# EAGLE design babyNamer (EAGLE 6.5.0)
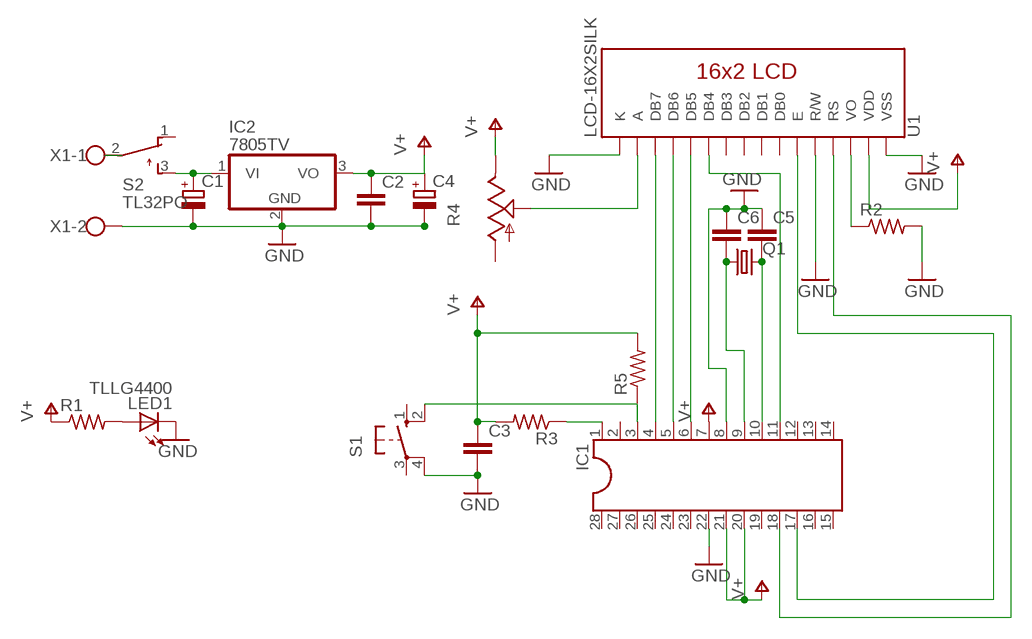
[diagram p0: schematic, sheet 1]

## Parts
C1  CPOL-EUE3.5-8  [E3,5-8]
C2  C-EU050-024X044  [C050-024X044]
C3  C-EU050-024X044  [C050-024X044]
C4  CPOL-EUE3.5-8  [E3,5-8]
C5  C-EU050-024X044  [C050-024X044]
C6  C-EU050-024X044  [C050-024X044]
IC1  DIL28-3  [DIL28-3]
IC2  7805TV  [TO220V]
LED1  TLLG4400  [LED3MM]
Q1  CRYSTALHC49US  [HC49US]
R1  R-US_0204/7  [0204/7]
R2  R-US_0204/7  [0204/7]
R3  R-US_0204/7  [0204/7]
R4  TRIM_US-CA9V  [CA9V]
R5  R-US_0204/7  [0204/7]
S1  10-XX  [B3F-10XX]
S2  TL32PO  [TL3XPO]
U1  LCD-16X2SILK  [LCD-16X2]
X1  W237-102  [W237-102]

## Nets
GND: C1.- C2.2 C3.2 C4.- C5.1 C6.1 IC1.8 IC1.22 IC2.2(GND) LED1.K(C) R2.2 S1.4(P1) U1.1(VSS) U1.5(R/W) U1.16(K) X1.2
N$1: IC1.17 U1.6(E)
N$2: R2.1 U1.3(VO)
N$3: IC1.11 U1.11(DB4)
N$4: IC1.18 U1.4(RS)
N$6: S2.2(P) X1.1
N$7: R4.S U1.15(A)
N$8: IC1.4 U1.14(DB7)
N$9: IC1.5 U1.13(DB6)
N$10: IC1.6 U1.12(DB5)
N$11: C1.+ IC2.1(VI) S2.3(S)
N$12: LED1.A R1.2
N$13: C5.2 IC1.10 Q1.2
N$14: C6.2 IC1.9 Q1.1
N$15: IC1.1 R3.1
N$16: IC1.3 R5.1 S1.2(S1)
V+: C2.1 C3.1 C4.+ IC1.7 IC1.20 IC1.21 IC2.3(VO) R1.1 R3.2 R4.E R5.2 U1.2(VDD)
Unconnected: IC1.2 IC1.12 IC1.13 IC1.14 IC1.15 IC1.16 IC1.19 IC1.23 IC1.24 IC1.25 IC1.26 IC1.27 IC1.28 R4.A S1.1(S) S1.3(P) S2.1(O) U1.7(DB0) U1.8(DB1) U1.9(DB2) U1.10(DB3)

## Library data of the parts
C1 C4 = rcl:CPOL-EU: POLARIZED CAPACITOR, European symbol
C2 C3 C5 C6 = rcl:C-EU: CAPACITOR, European symbol
IC1 = ic-package:DIL28: Dual In Line
IC2 = linear:78*: Positive VOLTAGE REGULATOR Source: http://cache.national.com/ds/LM/LM78L05.pdf http://www.fairchildsemi.com/ds/LM/LM7805.pdf
LED1 = led:TLLG4400: Low Current (2mA) LED 3 mm Tinted Diffused Package color GREEN Source: Data sheet <http://www.farnell.com/datasheets/391098.pdf>; MF: VISHAY SEMICONDUCTOR; OC_FARNELL: 1612435
Q1 = SparkFun-FreqCtrl:CRYSTAL: Various standard crystals. Proven footprints. Spark Fun Electronics SKU : COM-00534
R1-R3 R5 = rcl:R-US_: RESISTOR, American symbol
R4 = pot:TRIM_US-: POTENTIOMETER
S1 = switch-omron:10-XX: OMRON SWITCH; MPN: B3F-1000; OC_FARNELL: 176432; OC_NEWARK: 36M3542
S2 = switch:TL32PO: TINY SWITCH ON - MOM Source: http://www2.produktinfo.conrad.com/datenblaetter/700000-724999/705152-da-01-de-Subminiaturschalter_TL_36YO.pdf
U1 = SparkFun-Displays:LCD-16X2: Standard text-only 16x2 parallel input LCD
X1 = con-wago-500:W237-102: WAGO SCREW CLAMP; MPN: 237-102; OC_FARNELL: unknown; OC_NEWARK: 70K9898

## Board
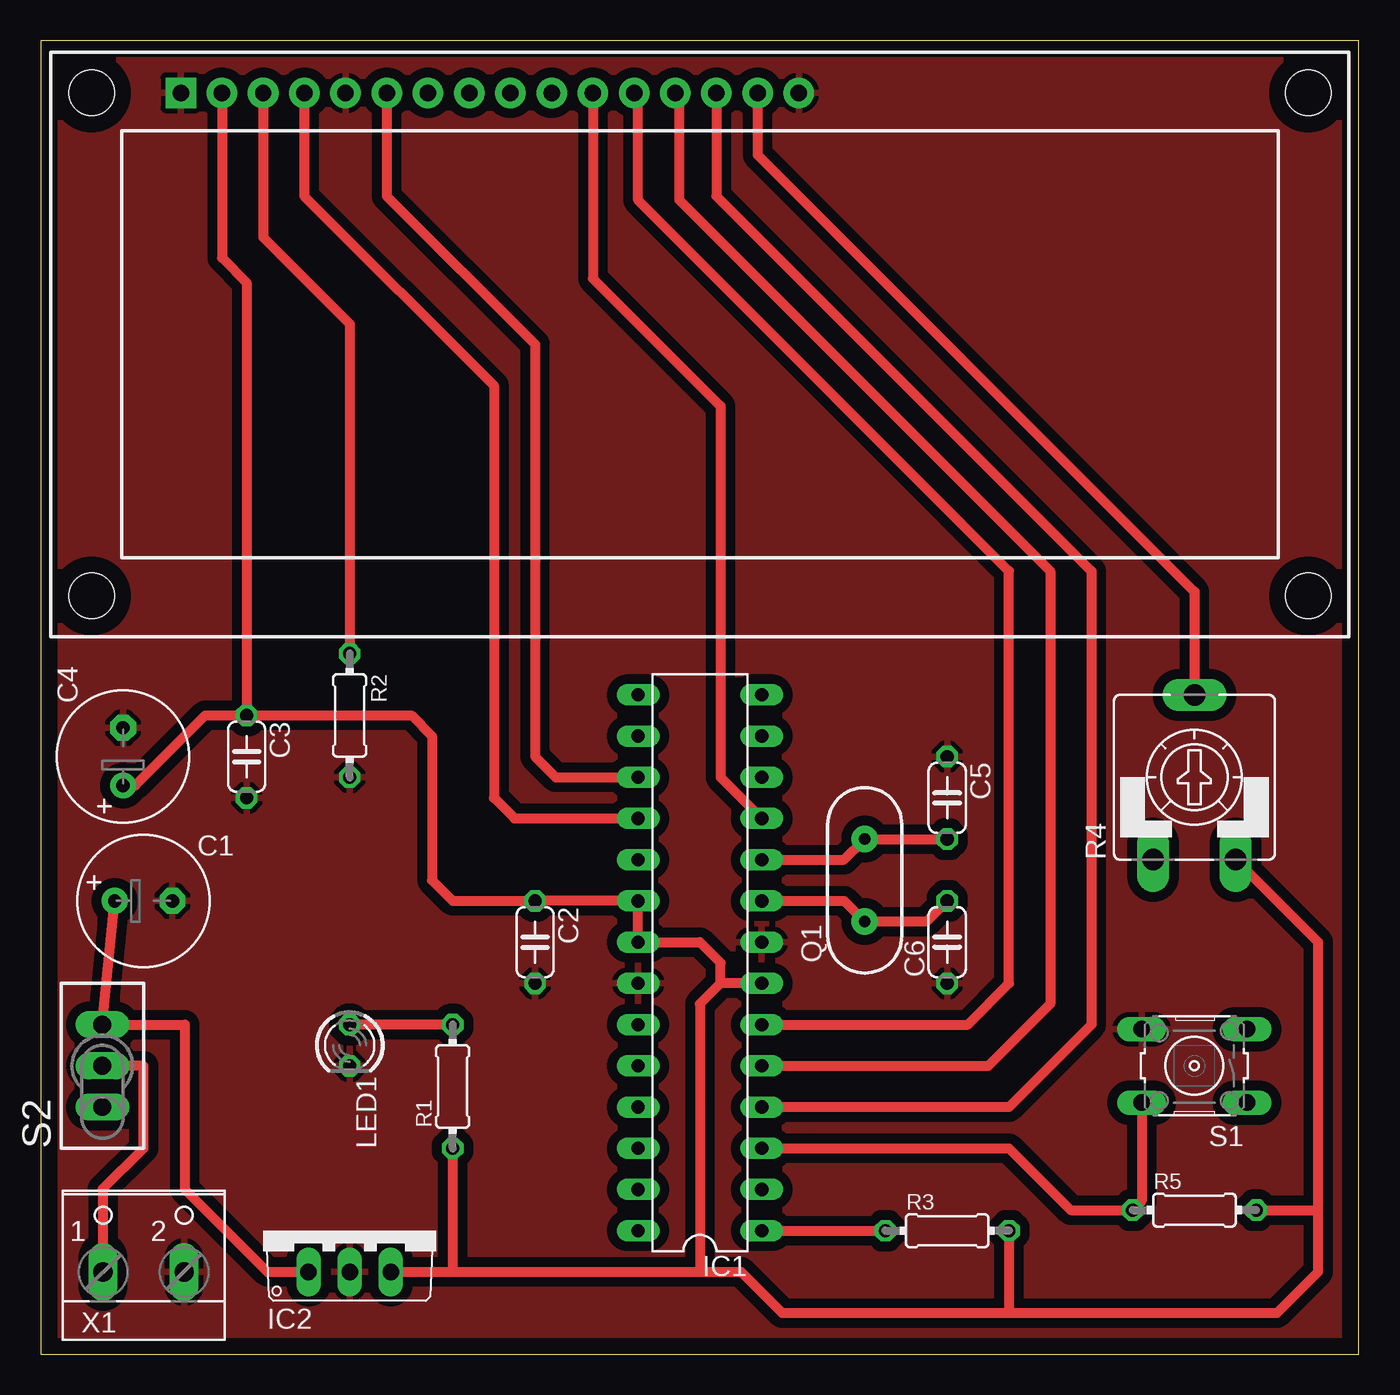
[diagram p1: board, top side]
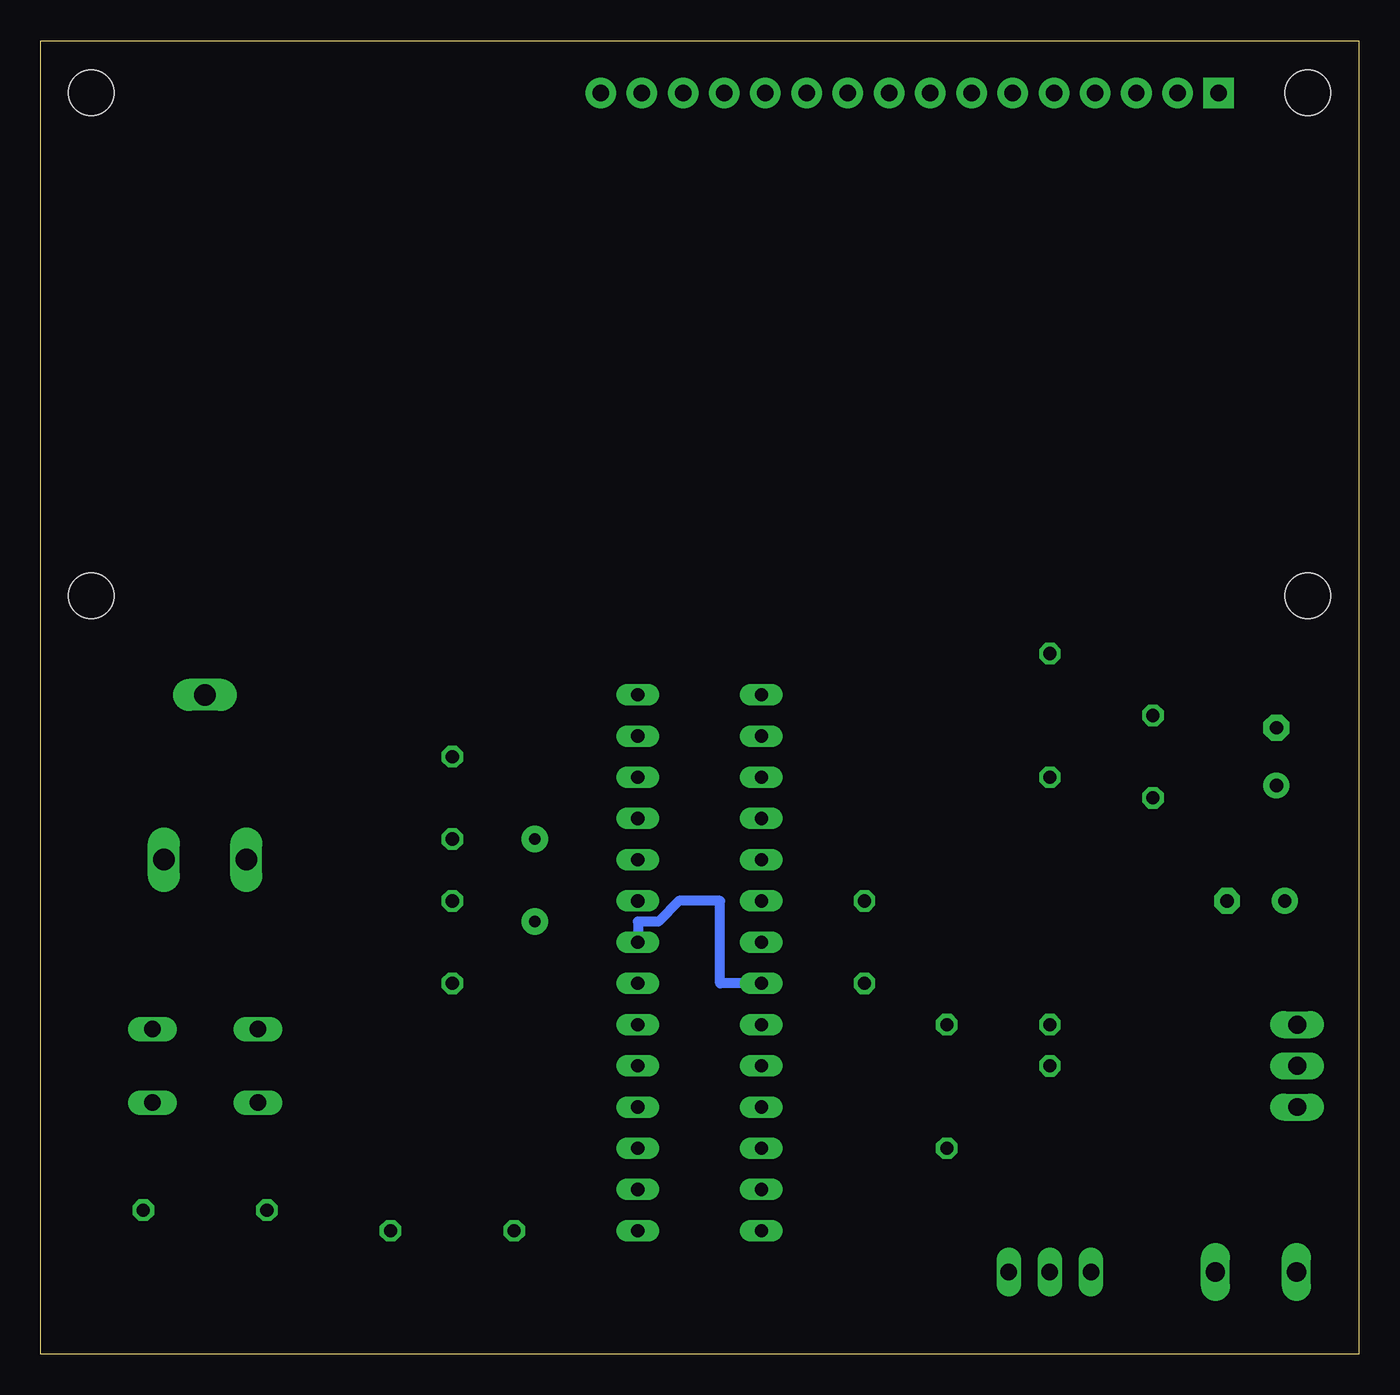
[diagram p2: board, bottom side, seen from below]

Size 81.26 x 80.95 mm. Coordinates in mm from the lower left corner, seen from the top.
Outline: 0,0 81.26,0 81.26,80.95 0,80.95 0,0
Copper layers (1*16): Top 0.035mm / dielectric 1.5mm / Bottom 0.035mm
Design rules "default *": minimum track width 12mil, minimum drill 24mil, track to track 12mil, track to pad 12mil, pad to pad 12mil, via to via 12mil, smd to smd 12mil, copper to edge 40mil, drill to drill 8mil, minimum pad ring 10mil, minimum via ring 8mil, stop-mask expansion 10mil, vias tented up to drill 0mil, thermal gap 12mil

### Footprints (pad centres in the part's own frame; a part is rotated, then mirrored left to right if it is on the bottom)
E3,5-8 = drill 0.813 pad 1.6: + -1.778,0 | drill 0.813 pad 1.6 octagon: - 1.778,0
C050-024X044 = drill 0.813 octagon: 1 -2.54,0; 2 2.54,0
DIL28-3 = drill 0.813 long: 1 -16.51,-3.81; 2 -13.97,-3.81; 3 -11.43,-3.81; 4 -8.89,-3.81; 5 -6.35,-3.81; 6 -3.81,-3.81; 7 -1.27,-3.81; 8 1.27,-3.81; 9 3.81,-3.81; 10 6.35,-3.81; 11 8.89,-3.81; 12 11.43,-3.81; 13 13.97,-3.81; 14 16.51,-3.81; 15 16.51,3.81; 16 13.97,3.81; 17 11.43,3.81; 18 8.89,3.81; 19 6.35,3.81; 20 3.81,3.81; 21 1.27,3.81; 22 -1.27,3.81; 23 -3.81,3.81; 24 -6.35,3.81; 25 -8.89,3.81; 26 -11.43,3.81; 27 -13.97,3.81; 28 -16.51,3.81
TO220V = drill 1.016 long: 1 -2.54,-2.54; 2 0,-2.54; 3 2.54,-2.54
LED3MM = drill 0.813 octagon: A -1.27,0; K 1.27,0
HC49US = drill 0.7 pad 1.651: 1 -2.54,0; 2 2.54,0
0204/7 = drill 0.813 octagon: 1 -3.81,0; 2 3.81,0
CA9V = drill 1.321 long: A -2.54,-5.08; E 2.54,-5.08; S 0,5.08
B3F-10XX = drill 1.016 long: 1 -3.251,2.261; 2 3.251,2.261; 3 -3.251,-2.261; 4 3.251,-2.261
TL3XPO = drill 1.1 pad 1.422 long: 1 -2.54,0; 2 0,0; 3 2.54,0
LCD-16X2 = drill 1.016 pad 1.88 square: 1 -32,15.5 | drill 1.016 pad 1.88: 2 -29.46,15.5; 3 -26.92,15.5; 4 -24.38,15.5; 5 -21.84,15.5; 6 -19.3,15.5; 7 -16.76,15.5; 8 -14.22,15.5; 9 -11.68,15.5; 10 -9.14,15.5; 11 -6.6,15.5; 12 -4.06,15.5; 13 -1.52,15.5; 14 1.02,15.5; 15 3.56,15.5; 16 6.1,15.5 | hole 2.8: -37.5,15.5; -37.5,-15.5; 37.5,15.5; 37.5,-15.5
W237-102 = drill 1.194 long: 1 -2.5,-1.27; 2 2.5,-1.27

### Placement (x,y rotation side)
C1  6.35,27.94 0 top
C2  30.48,25.4 270 top
C3  12.7,36.83 270 top
C4  5.08,36.83 90 top
C5  55.88,34.29 270 top
C6  55.88,25.4 90 top
IC1  40.64,24.13 90 top
IC2  19.05,7.62 0 top
LED1  19.05,19.05 270 top
Q1  50.8,29.21 90 top
R1  25.4,16.51 90 top
R2  19.05,39.37 270 top
R3  55.88,7.62 0 top
R4  71.12,35.56 0 top
R5  71.12,8.89 0 top
S1  71.12,17.78 180 top
S2  3.81,17.78 90 top
U1  40.64,62.23 0 top
X1  6.35,6.35 0 top

### Tracks (layer width: path | path; a pad name or v marks a point on that pad's centre or on a via)
GND
  Bottom 0.61: IC1.22 39.37,22.86 39.37,27.94 41.91,27.94 43.18,26.67 44.45,26.67 IC1.8
  pour Top (isolate 0.61): 0,81.28 81.28,81.28 81.28,0 0,0
N$1
  Top 0.61: U1.6 21.34,71.37 30.48,62.23 30.48,36.83 31.75,35.56 IC1.17
N$2
  Top 0.61: U1.3 13.72,68.83 19.05,63.5 R2.1
N$3
  Top 0.61: U1.11 34.04,66.29 41.91,58.42 41.91,35.56 IC1.11
N$4
  Top 0.61: U1.4 16.26,71.37 27.94,59.69 27.94,34.29 29.21,33.02 IC1.18
N$6
  Top 0.61: X1.1 3.85,10.12 3.81,10.16 6.35,12.7 6.35,17.78 S2.2
N$7
  Top 0.61: U1.15 44.2,73.91 71.12,46.99 R4.S
N$8
  Top 0.61: U1.14 41.66,71.37 64.77,48.26 64.77,20.32 59.69,15.24 IC1.4
N$9
  Top 0.61: IC1.5 58.42,17.78 62.23,21.59 62.23,48.26 39.37,71.12 39.37,77.48 U1.13
N$10
  Top 0.61: IC1.6 57.15,20.32 59.69,22.86 59.69,48.26 36.83,71.12 36.83,77.48 U1.12
N$11
  Top 0.61: IC2.1 13.97,5.08 8.89,10.16 8.89,20.32 S2.3 C1.+
N$12
  Top 0.61: R1.2 LED1.A
N$13
  Top 0.61: IC1.10 49.53,30.48 Q1.2 C5.2
N$14
  Top 0.61: IC1.9 49.53,27.94 Q1.1 54.61,26.67 C6.2
N$15
  Top 0.61: IC1.1 R3.1
N$16
  Top 0.61: S1.2 67.87,9.45 R5.1 63.5,8.89 59.69,12.7 IC1.3
V+
  Top 0.61: 59.69,2.54 76.2,2.54 78.74,5.08 78.74,8.89 | 59.69,2.54 45.72,2.54 43.18,5.08 40.64,5.08 | C4.+ 5.84,35.05 10.16,39.37 C3.1 | U1.2 11.18,67.56 12.7,66.04 C3.1 | R3.2 59.69,2.54 | IC2.3 25.4,5.08 | 25.4,5.08 40.64,5.08 | R1.1 25.4,5.08 | C3.1 22.86,39.37 24.13,38.1 24.13,29.21 25.4,27.94 C2.1 IC1.20 IC1.21 40.64,25.4 41.91,24.13 41.91,22.86 | 78.74,8.89 78.74,25.4 R4.E | R5.2 78.74,8.89 | IC1.7 41.91,22.86 | 41.91,22.86 40.64,21.59 40.64,5.08